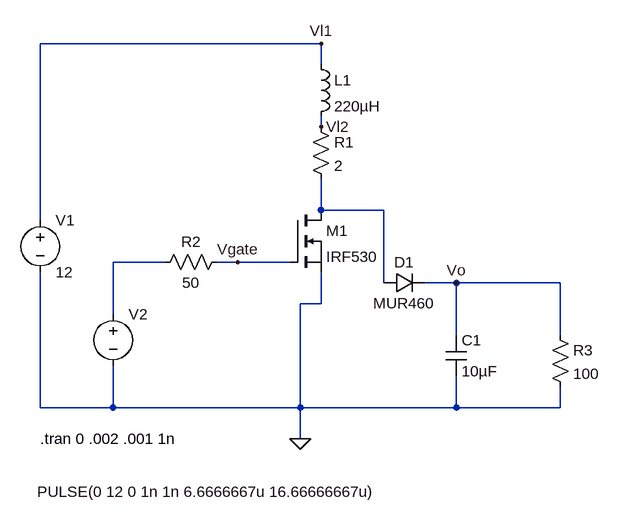
[diagram p0: schematic 3a.asc]
3a.asc, the LTspice schematic file:
Version 4
SHEET 1 932 680
WIRE 496 -224 64 -224
WIRE 496 -192 496 -224
WIRE 496 -96 496 -112
WIRE 496 32 496 -16
WIRE 592 32 496 32
WIRE 64 48 64 -224
WIRE 256 112 176 112
WIRE 368 112 336 112
WIRE 448 112 368 112
WIRE 592 144 592 32
WIRE 704 144 656 144
WIRE 864 144 704 144
WIRE 496 176 496 128
WIRE 496 176 464 176
WIRE 176 192 176 112
WIRE 704 224 704 144
WIRE 864 224 864 144
WIRE 64 336 64 128
WIRE 176 336 176 272
WIRE 176 336 64 336
WIRE 464 336 464 176
WIRE 464 336 176 336
WIRE 704 336 704 288
WIRE 704 336 464 336
WIRE 864 336 864 304
WIRE 864 336 704 336
WIRE 464 384 464 336
FLAG 464 384 0
FLAG 496 -224 Vl1
FLAG 496 -96 Vl2
FLAG 704 144 Vo
FLAG 368 112 Vgate
SYMBOL voltage 64 32 R0
WINDOW 123 0 0 Left 0
WINDOW 39 0 0 Left 0
SYMATTR InstName V1
SYMATTR Value 12
SYMBOL voltage 176 176 R0
WINDOW 3 -117 289 Left 2
WINDOW 123 0 0 Left 0
WINDOW 39 0 0 Left 0
SYMATTR Value PULSE(0 12 0 1n 1n 6.6666667u 16.66666667u)
SYMATTR InstName V2
SYMBOL ind 480 -208 R0
SYMATTR InstName L1
SYMATTR Value 220µH
SYMBOL res 480 -112 R0
SYMATTR InstName R1
SYMATTR Value 2
SYMBOL res 352 96 R90
WINDOW 0 0 56 VBottom 2
WINDOW 3 32 56 VTop 2
SYMATTR InstName R2
SYMATTR Value 50
SYMBOL diode 592 160 R270
WINDOW 0 32 32 VTop 2
WINDOW 3 0 32 VBottom 2
SYMATTR InstName D1
SYMATTR Value MUR460
SYMBOL cap 688 224 R0
SYMATTR InstName C1
SYMATTR Value 10µF
SYMBOL res 848 208 R0
SYMATTR InstName R3
SYMATTR Value 100
SYMBOL nmos 448 32 R0
SYMATTR InstName M1
SYMATTR Value IRF530
TEXT 64 384 Left 2 !.tran 0 .002 .001 1n

The netlist it stands for:
* 3a.asc
V1 Vl1 0 12
V2 N002 0 PULSE(0 12 0 1n 1n 6.6666667u 16.66666667u)
L1 Vl1 Vl2 220µH
R1 Vl2 N001 2
R2 Vgate N002 50
D1 N001 Vo MUR460
C1 Vo 0 10µF
R3 Vo 0 100
M1 N001 Vgate 0 0 IRF530
.model D D
.lib standard.dio
.model NMOS NMOS
.model PMOS PMOS
.lib standard.mos
.tran 0 .002 .001 1n
.backanno
.end